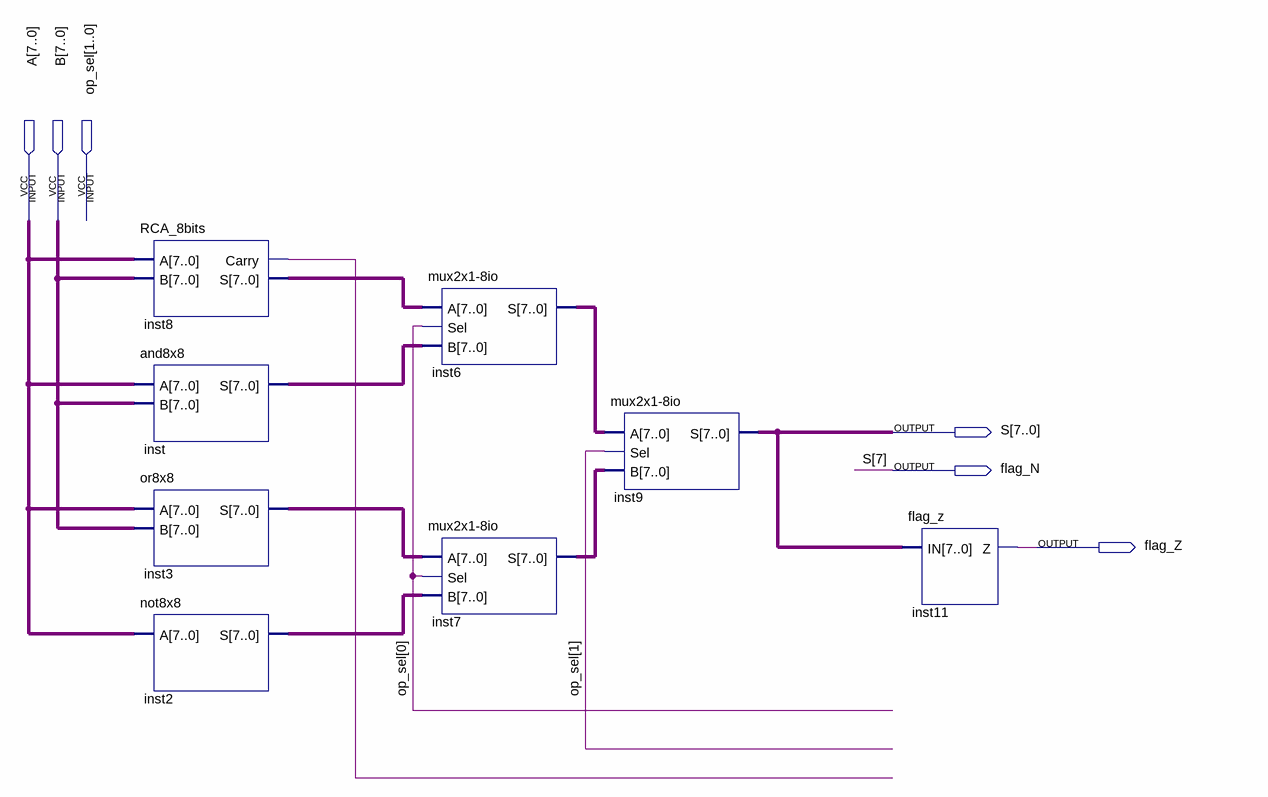
[diagram p0: schematic sheet]
// Quartus schematic ula.bdf as structural Verilog: 8 symbols, 6 pins
module ula (
  input  [7:0] A,
  input  [7:0] B,
  input  [1:0] op_sel,
  output [7:0] S,
  output flag_N,
  output flag_Z
);

  wire inst8_carry;
  wire [7:0] inst2_s, inst3_s, inst6_s, inst7_s, inst8_s, inst_s;

  RCA_8bits inst8 (.A(A), .B(B), .Carry(inst8_carry), .S(inst8_s));
  and8x8 inst (.A(A), .B(B), .S(inst_s));
  or8x8 inst3 (.A(A), .B(B), .S(inst3_s));
  not8x8 inst2 (.A(A), .S(inst2_s));
  \mux2x1-8io  inst6 (.A(inst8_s), .Sel(op_sel[0]), .B(inst_s), .S(inst6_s));
  \mux2x1-8io  inst7 (.A(inst3_s), .Sel(op_sel[0]), .B(inst2_s), .S(inst7_s));
  \mux2x1-8io  inst9 (.A(inst6_s), .Sel(op_sel[1]), .B(inst7_s), .S({flag_N, S[6:0]}));
  flag_z inst11 (.IN({flag_N, S[6:0]}), .Z(flag_Z));

  assign S[7] = flag_N;
endmodule
